# EAGLE schematic macro-keypad (EAGLE 9.6.2)
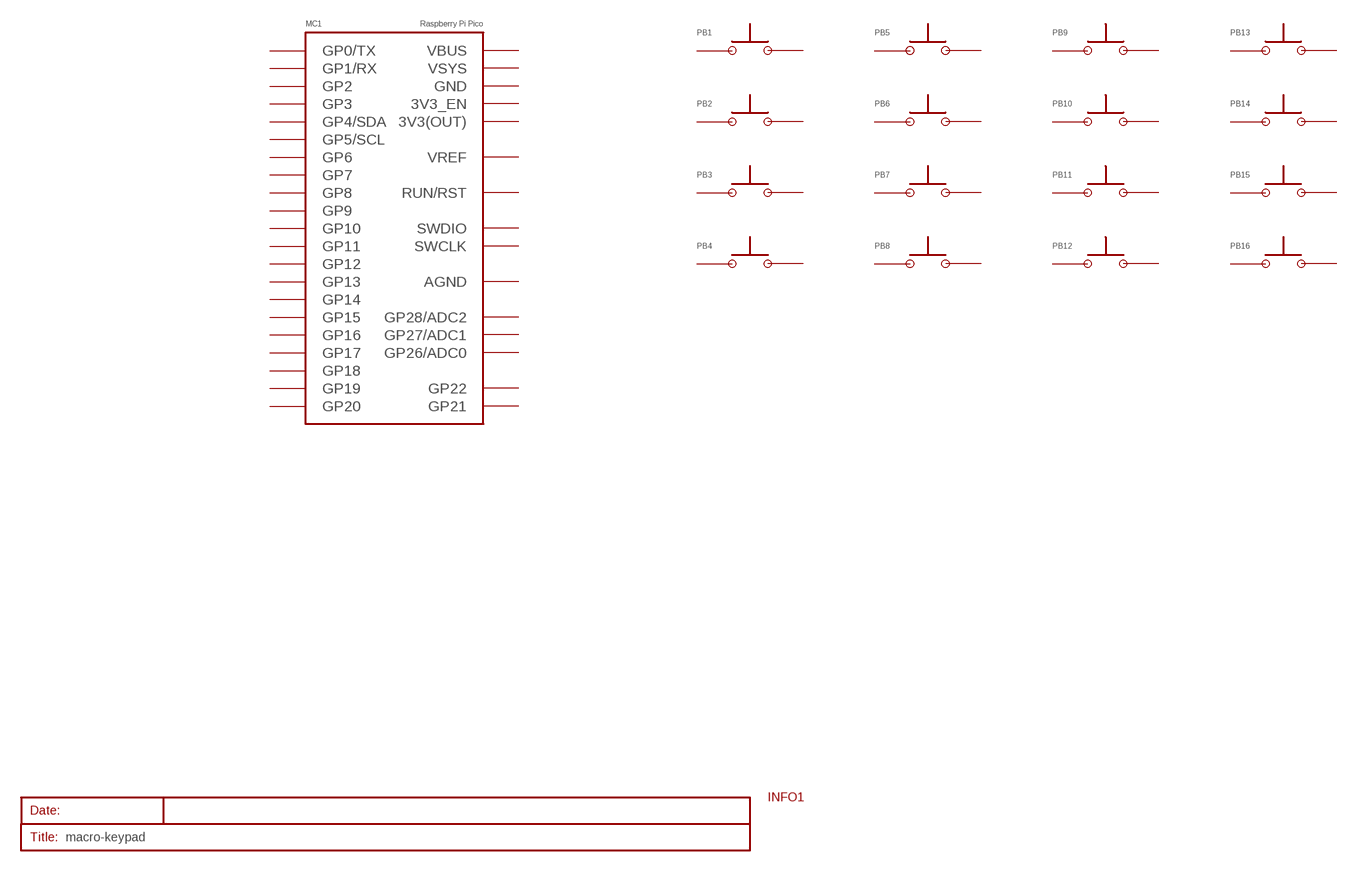
[diagram p0: schematic, sheet 1]

## Parts
INFO1  INFO_T  [INFO_T]
MC1  RASPBERRY-PI-PICO_THT  [RASPBERRY-PI-PICO_THT]
PB1  MOMENTARY-SWITCH_NO_PUSHBUTTON  [6MM_PUSHBUTTON]
PB2  MOMENTARY-SWITCH_NO_PUSHBUTTON  [6MM_PUSHBUTTON]
PB3  MOMENTARY-SWITCH_NO_PUSHBUTTON  [6MM_PUSHBUTTON]
PB4  MOMENTARY-SWITCH_NO_PUSHBUTTON  [6MM_PUSHBUTTON]
PB5  MOMENTARY-SWITCH_NO_PUSHBUTTON  [6MM_PUSHBUTTON]
PB6  MOMENTARY-SWITCH_NO_PUSHBUTTON  [6MM_PUSHBUTTON]
PB7  MOMENTARY-SWITCH_NO_PUSHBUTTON  [6MM_PUSHBUTTON]
PB8  MOMENTARY-SWITCH_NO_PUSHBUTTON  [6MM_PUSHBUTTON]
PB9  MOMENTARY-SWITCH_NO_PUSHBUTTON  [6MM_PUSHBUTTON]
PB10  MOMENTARY-SWITCH_NO_PUSHBUTTON  [6MM_PUSHBUTTON]
PB11  MOMENTARY-SWITCH_NO_PUSHBUTTON  [6MM_PUSHBUTTON]
PB12  MOMENTARY-SWITCH_NO_PUSHBUTTON  [6MM_PUSHBUTTON]
PB13  MOMENTARY-SWITCH_NO_PUSHBUTTON  [6MM_PUSHBUTTON]
PB14  MOMENTARY-SWITCH_NO_PUSHBUTTON  [6MM_PUSHBUTTON]
PB15  MOMENTARY-SWITCH_NO_PUSHBUTTON  [6MM_PUSHBUTTON]
PB16  MOMENTARY-SWITCH_NO_PUSHBUTTON  [6MM_PUSHBUTTON]
SCHEMATIC1  SHEET  [SHEET]
Unconnected: MC1.1(GP0/TX) MC1.2(GP1/RX) MC1.4(GP2) MC1.5(GP3) MC1.6(GP4/SDA) MC1.7(GP5/SCL) MC1.9(GP6) MC1.10(GP7) MC1.11(GP8) MC1.12(GP9) MC1.14(GP10) MC1.15(GP11) MC1.16(GP12) MC1.17(GP13) MC1.19(GP14) MC1.20(GP15) MC1.21(GP16) MC1.22(GP17) MC1.24(GP18) MC1.25(GP19) MC1.26(GP20) MC1.27(GP21) MC1.29(GP22) MC1.30(RUN/RST) MC1.31(GP26/ADC0) MC1.32(GP27/ADC1) MC1.34(GP28/ADC2) MC1.35(VREF) MC1.36(3V3(OUT)) MC1.37(3V3_EN) MC1.39(VSYS) MC1.40(VBUS) MC1.SWCLK MC1.SWDIO PB1.1_A PB1.1_B PB1.2_A PB1.2_B PB2.1_A PB2.1_B PB2.2_A PB2.2_B PB3.1_A PB3.1_B PB3.2_A PB3.2_B PB4.1_A PB4.1_B PB4.2_A PB4.2_B PB5.1_A PB5.1_B PB5.2_A PB5.2_B PB6.1_A PB6.1_B PB6.2_A PB6.2_B PB7.1_A PB7.1_B PB7.2_A PB7.2_B PB8.1_A PB8.1_B PB8.2_A PB8.2_B PB9.1_A PB9.1_B PB9.2_A PB9.2_B PB10.1_A PB10.1_B PB10.2_A PB10.2_B PB11.1_A PB11.1_B PB11.2_A PB11.2_B PB12.1_A PB12.1_B PB12.2_A PB12.2_B PB13.1_A PB13.1_B PB13.2_A PB13.2_B PB14.1_A PB14.1_B PB14.2_A PB14.2_B PB15.1_A PB15.1_B PB15.2_A PB15.2_B PB16.1_A PB16.1_B PB16.2_A PB16.2_B

## Power pins joined to a net without a drawn wire
AGND: MC1.33(AGND)
GND: MC1.3(GND) MC1.8(GND) MC1.13(GND) MC1.18(GND) MC1.23(GND) MC1.28(GND) MC1.38(GND) MC1.D_GND(GND)

## Library data of the parts
INFO1 = myLibrary:INFO
MC1 = myLibrary:RASPBERRY-PI-PICO
PB1-PB16 = myLibrary:MOMENTARY-SWITCH_NO
SCHEMATIC1 = myLibrary:SHEET